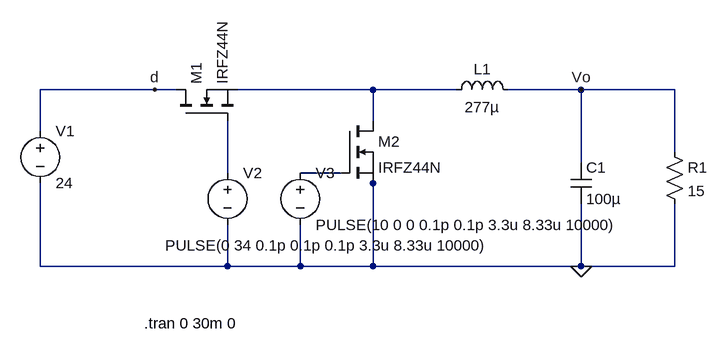
[diagram p0: schematic Regulador_buck (1) (1).asc]
Regulador_buck (1) (1).asc, the LTspice schematic file:
Version 4.1
SHEET 1 2392 680
WIRE 208 48 32 48
WIRE 240 48 208 48
WIRE 544 48 336 48
WIRE 672 48 544 48
WIRE 864 48 752 48
WIRE 1008 48 864 48
WIRE 544 96 544 48
WIRE 32 112 32 48
WIRE 1008 144 1008 48
WIRE 864 160 864 48
WIRE 320 176 320 96
WIRE 496 176 432 176
WIRE 544 192 544 176
WIRE 32 320 32 192
WIRE 320 320 320 256
WIRE 320 320 32 320
WIRE 432 320 432 256
WIRE 432 320 320 320
WIRE 544 320 544 192
WIRE 544 320 432 320
WIRE 864 320 864 224
WIRE 864 320 544 320
WIRE 1008 320 1008 224
WIRE 1008 320 864 320
FLAG 864 320 0
FLAG 864 48 Vo
FLAG 208 48 d
DATAFLAG 432 112 ""
DATAFLAG 144 48 ""
DATAFLAG 864 48 ""
SYMBOL voltage 32 96 R0
WINDOW 123 0 0 Left 0
WINDOW 39 0 0 Left 0
SYMATTR InstName V1
SYMATTR Value 24
SYMBOL res 992 128 R0
SYMATTR InstName R1
SYMATTR Value 15
SYMBOL voltage 320 160 R0
WINDOW 123 0 0 Left 0
WINDOW 39 0 0 Left 0
WINDOW 3 -96 128 Left 2
SYMATTR InstName V2
SYMATTR Value PULSE(0 34 0.1p 0.1p 0.1p 3.3u 8.33u 10000)
SYMBOL voltage 432 160 R0
WINDOW 123 0 0 Left 0
WINDOW 39 0 0 Left 0
SYMATTR InstName V3
SYMATTR Value PULSE(10 0 0 0.1p 0.1p 3.3u 8.33u 10000)
SYMBOL cap 848 160 R0
SYMATTR InstName C1
SYMATTR Value 100µ
SYMBOL ind 656 64 R270
WINDOW 0 32 56 VTop 2
WINDOW 3 5 56 VBottom 2
SYMATTR InstName L1
SYMATTR Value 277µ
SYMBOL nmos 496 96 R0
SYMATTR InstName M2
SYMATTR Value IRFZ44N
SYMBOL nmos 240 96 R270
SYMATTR InstName M1
SYMATTR Value IRFZ44N
TEXT 192 408 Left 2 !.tran 0 30m 0

The netlist it stands for:
* Regulador_buck (1) (1).asc
V1 d 0 24
R1 Vo 0 15
V2 N002 0 PULSE(0 34 0.1p 0.1p 0.1p 3.3u 8.33u 10000)
V3 N003 0 PULSE(10 0 0 0.1p 0.1p 3.3u 8.33u 10000)
C1 Vo 0 100µ
L1 N001 Vo 277µ
M2 N001 N003 0 0 IRFZ44N
M1 d N002 N001 N001 IRFZ44N
.model NMOS NMOS
.model PMOS PMOS
.lib standard.mos
.tran 0 30m 0
.backanno
.end